# Altium schematic sheet Placa1.SchDoc
size A4; SheetNumber: 1; SheetTotal: 1
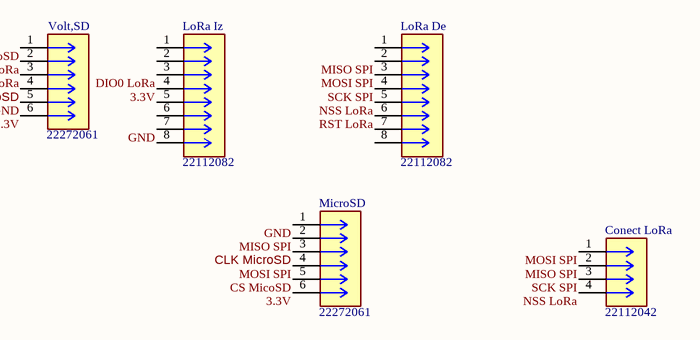
[diagram p0: Placa1.SchDoc]

## Parts
Conect_LoRa  22112042  [CONN_A-6373-04A_MOL]
LoRa_De  22112082  [CONN_A-6373-08A_MOL]
LoRa_Iz  22112082  [CONN_A-6373-08A_MOL]
MicroSD  22272061  [CONN_AE-6410-06A_MOL]
Volt,SD  22272061  [CONN_AE-6410-06A_MOL]

## Nets
3.3V: LoRa_Iz.4 MicroSD.6 Volt,SD.6
CLK MicroSD: MicroSD.3 Volt,SD.4
CS MicoSD: MicroSD.5 Volt,SD.1
DIO0 LoRa: LoRa_Iz.3 Volt,SD.3
GND: LoRa_Iz.7 MicroSD.1 Volt,SD.5
MISO SPI: Conect_LoRa.2 LoRa_De.2 MicroSD.2
MOSI SPI: Conect_LoRa.1 LoRa_De.3 MicroSD.4
NSS LoRa: Conect_LoRa.4 LoRa_De.5
RST LoRa: LoRa_De.6 Volt,SD.2
SCK SPI: Conect_LoRa.3 LoRa_De.4

Not connected (* = marked no-connect by the designer): LoRa_De 1 7 8; LoRa_Iz 1 2 5 6 8

## Library data of the parts
LoRa_De LoRa_Iz = 22112082: KKÂ® 254 Solid Header, Vertical, with Friction Lock, 8 Circuits, Gold (Au) Plating; MF: Molex; SnapEDA_Link: https://www.snapeda.com/parts/22-11-2082/Molex/view-part/?ref=snap; Package: None; Value: *; MP: 22-11-2082; Check_prices: https://www.snapeda.com/parts/22-11-2082/Molex/view-part/?ref=eda
Conect_LoRa = 22112042: Package: None; Price: None; Value: *; MP: 22112042; Availability: Unavailable
MicroSD Volt,SD = 22272061: Package: None; Price: None; Value: *; MP: 22272061; Availability: Unavailable